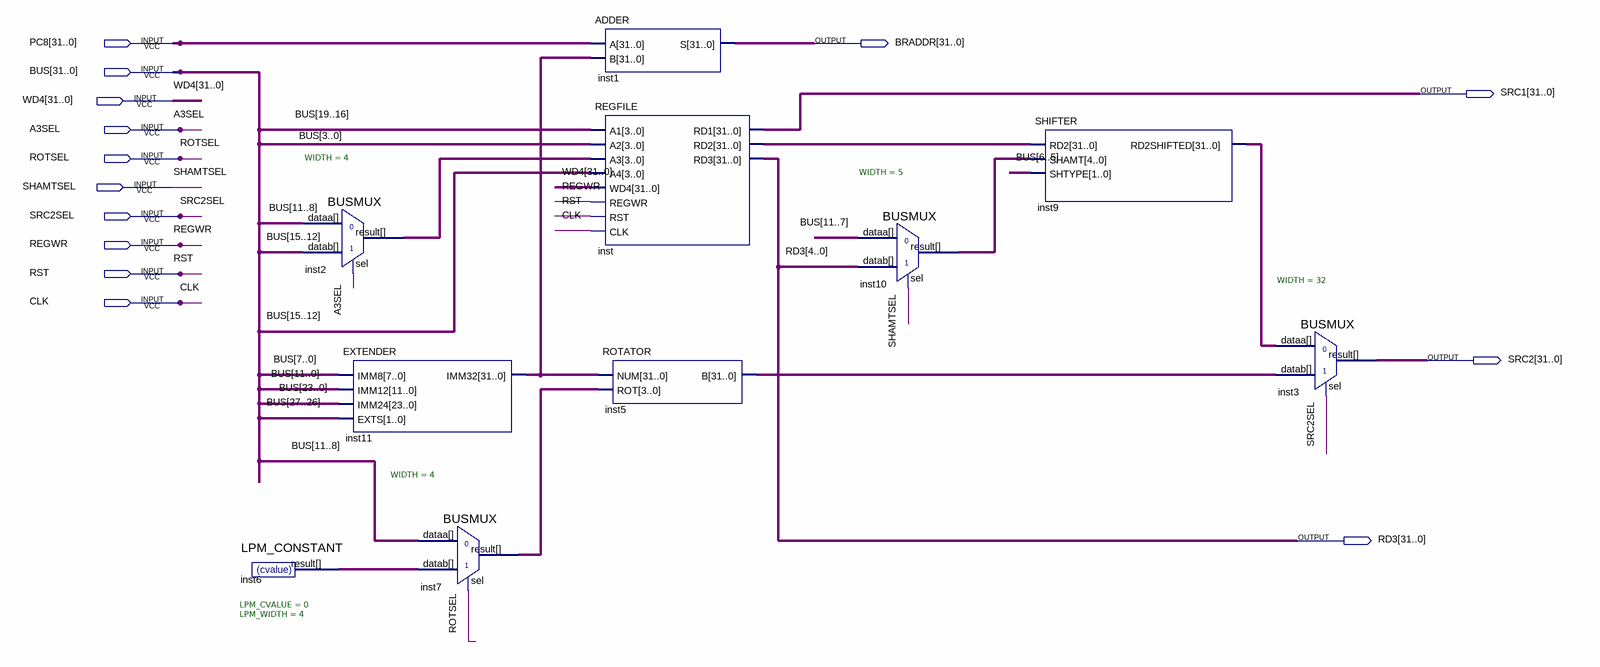
[diagram p0: schematic sheet]
// Quartus schematic decode.bdf as structural Verilog: 10 symbols, 14 pins
module decode (
  input  [31:0] PC8,
  input  [31:0] BUS,
  input  [31:0] WD4,
  input  A3SEL,
  input  ROTSEL,
  input  SHAMTSEL,
  input  SRC2SEL,
  input  REGWR,
  input  RST,
  input  CLK,
  output [31:0] BRADDR,
  output [31:0] SRC1,
  output [31:0] SRC2,
  output [31:0] RD3
);

  wire [3:0] inst2_result, inst6_result, inst7_result;
  wire [4:0] inst10_result;
  wire [31:0] inst5_b, inst9_rd2shifted, inst11_imm32, inst_rd2;

  LPM_CONSTANT #(.LPM_CVALUE(0), .LPM_WIDTH(4)) inst6 (.result(inst6_result));
  BUSMUX #(.WIDTH(4)) inst2 (.datab(BUS[15:12]), .sel(A3SEL), .dataa(BUS[11:8]), .result(inst2_result));
  EXTENDER inst11 (.IMM8(BUS[7:0]), .IMM12(BUS[11:0]), .IMM24(BUS[23:0]), .EXTS(BUS[27:26]), .IMM32(inst11_imm32));
  BUSMUX #(.WIDTH(4)) inst7 (.datab(inst6_result), .sel(ROTSEL), .dataa(BUS[11:8]), .result(inst7_result));
  ADDER inst1 (.A(PC8), .B(inst11_imm32), .S(BRADDR));
  REGFILE inst (
    .A1(BUS[19:16]), .A2(BUS[3:0]), .A3(inst2_result), .A4(BUS[15:12]), .WD4(WD4), .REGWR(REGWR), .RST(RST),
    .CLK(CLK), .RD1(SRC1), .RD2(inst_rd2), .RD3(RD3));
  ROTATOR inst5 (.NUM(inst11_imm32), .ROT(inst7_result), .B(inst5_b));
  BUSMUX #(.WIDTH(5)) inst10 (.datab(RD3[4:0]), .sel(SHAMTSEL), .dataa(BUS[11:7]), .result(inst10_result));
  SHIFTER inst9 (.RD2(inst_rd2), .SHAMT(inst10_result), .SHTYPE(BUS[6:5]), .RD2SHIFTED(inst9_rd2shifted));
  BUSMUX #(.WIDTH(32)) inst3 (.datab(inst5_b), .sel(SRC2SEL), .dataa(inst9_rd2shifted), .result(SRC2));
endmodule
